# EAGLE design Temp Sensor B (EAGLE 8.4.0)
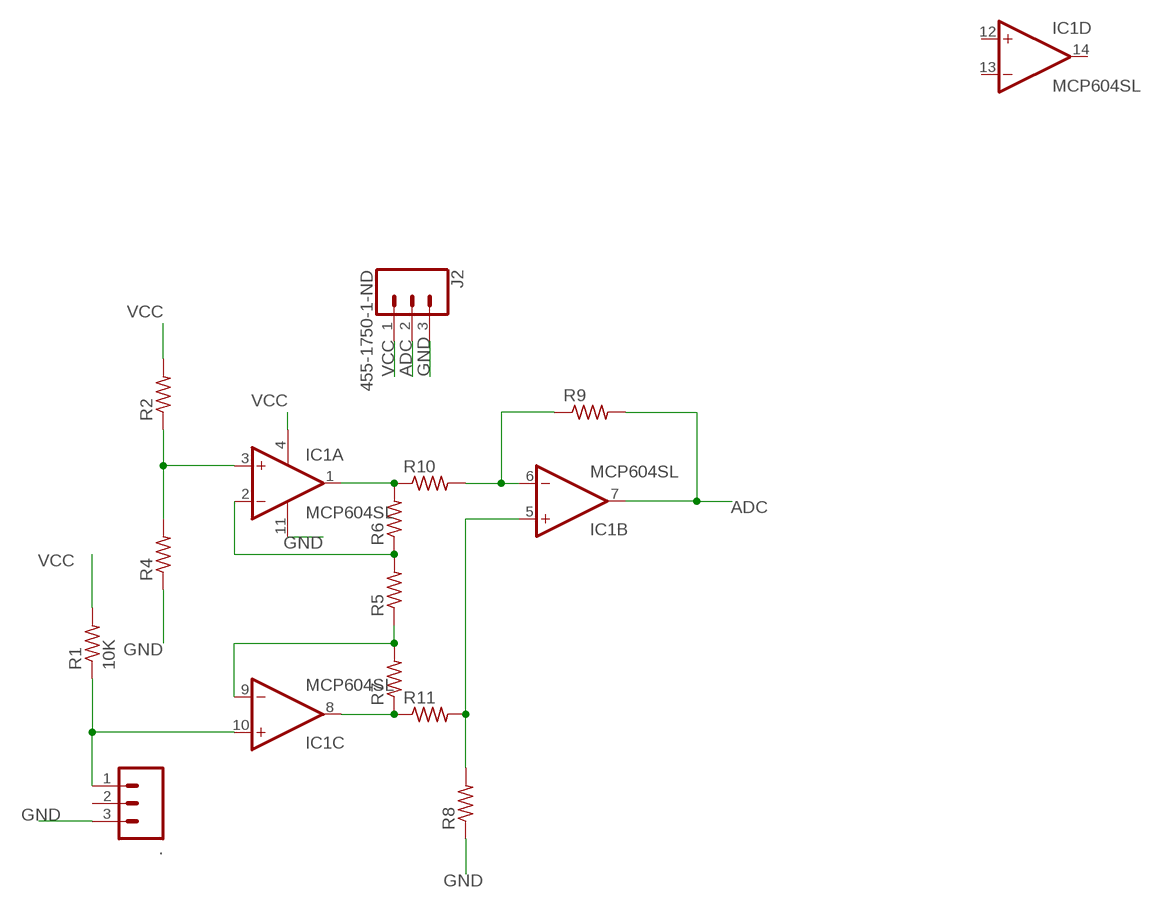
[diagram p0: schematic, sheet 1]

## Parts
.  CONN_03SCREW_LOCK  [SCREWTERMINAL-3.5MM-3_LOCK.007S]
IC1  MCP604SL  [SO14]
J2  455-1750-1-ND  CONN_03  [1X03]
R1  10K  R-US_R0603  [R0603]
R2  R-US_R0603  [R0603]
R4  R-US_R0603  [R0603]
R5  R-US_R0603  [R0603]
R6  R-US_R0603  [R0603]
R7  R-US_R0603  [R0603]
R8  R-US_R0603  [R0603]
R9  R-US_R0603  [R0603]
R10  R-US_R0603  [R0603]
R11  R-US_R0603  [R0603]

## Nets
ADC: IC1.7(B:OUT) J2.2 R9.2
GND: ..3 IC1.11(P:V-) J2.3 R4.1 R8.1
N$1: ..1 IC1.10(C:+IN) R1.1
N$2: IC1.3(A:+IN) R2.1 R4.2
N$3: IC1.8(C:OUT) R7.1 R11.1
N$5: IC1.1(A:OUT) R6.2 R10.1
N$7: IC1.2(A:-IN) R5.2 R6.1
N$8: IC1.9(C:-IN) R5.1 R7.2
N$11: IC1.5(B:+IN) R8.2 R11.2
N$12: IC1.6(B:-IN) R9.1 R10.2
VCC: IC1.4(P:V+) J2.1 R1.2 R2.2
Unconnected: ..2 IC1.12(D:+IN) IC1.13(D:-IN) IC1.14(D:OUT)

## Library data of the parts
. = SparkFun-Connectors:CONN_03: Multi connection point. Often used as Generic Header-pin footprint for 0.1 inch spaced/style header connections On any of the 0.1 inch spaced packages, you can populate with these: Break Away Headers - Straight <https://www.sparkfun.com/products/116> (PRT-00116) Break Away Male Headers - Right Angle <https://www.sparkfun.com/products/553> (PRT-00553) Female Headers <https://www.sparkfun.com/products/115> (PRT-00115) Break Away Headers - Machine Pin <https://www.sparkfun.com/products/117> (PRT-00117) Break Away Female Headers - Swiss Machine Pin <https://www.sparkfun.com/products/743> (PRT-00743) Stackable Header - 3 Pin (Female, 0.1") <https://www.sparkfun.com/products/13875> (PRT-13875) For SCREWTERMINALS and SPRING TERMINALS visit here: Screw Terimnals on SparkFun.com <https://www.sparkfun.com/search/results?term=Screw+Terminals> (5mm/3.5mm/2.54mm spacing) This device is also useful as a general connection point to wire up your design to another part of your project. Our various solder wires solder well into these plated through hole pads. Hook-Up Wire - Assortment (Stranded, 22 AWG) <https://www.sparkfun.com/products/11375> (PRT-11375) Hook-Up Wire - Assortment (Solid Core, 22 AWG) <https://www.sparkfun.com/products/11367> (PRT-11367) View the entire wire category on our website here <https://www.sparkfun.com/categories/141> Special notes: Molex polarized connector foot print use with SKU : PRT-08232 with associated crimp pins and housings.; PROD_ID: CONN-08288; SF_ID: PRT-08235
IC1 = linear:MCP604: Quad Op Amp 2.7V to 6.0V Single Supply CMOS Source: http://ww1.microchip.com/downloads/en/DeviceDoc/21314g.pdf
J2 = SparkFun-Connectors:CONN_03: Multi connection point. Often used as Generic Header-pin footprint for 0.1 inch spaced/style header connections On any of the 0.1 inch spaced packages, you can populate with these: Break Away Headers - Straight <https://www.sparkfun.com/products/116> (PRT-00116) Break Away Male Headers - Right Angle <https://www.sparkfun.com/products/553> (PRT-00553) Female Headers <https://www.sparkfun.com/products/115> (PRT-00115) Break Away Headers - Machine Pin <https://www.sparkfun.com/products/117> (PRT-00117) Break Away Female Headers - Swiss Machine Pin <https://www.sparkfun.com/products/743> (PRT-00743) Stackable Header - 3 Pin (Female, 0.1") <https://www.sparkfun.com/products/13875> (PRT-13875) For SCREWTERMINALS and SPRING TERMINALS visit here: Screw Terimnals on SparkFun.com <https://www.sparkfun.com/search/results?term=Screw+Terminals> (5mm/3.5mm/2.54mm spacing) This device is also useful as a general connection point to wire up your design to another part of your project. Our various solder wires solder well into these plated through hole pads. Hook-Up Wire - Assortment (Stranded, 22 AWG) <https://www.sparkfun.com/products/11375> (PRT-11375) Hook-Up Wire - Assortment (Solid Core, 22 AWG) <https://www.sparkfun.com/products/11367> (PRT-11367) View the entire wire category on our website here <https://www.sparkfun.com/categories/141> Special notes: Molex polarized connector foot print use with SKU : PRT-08232 with associated crimp pins and housings.; PROD_ID: XXX-00000
R1 R2 R4-R11 = resistor:R-US_: RESISTOR, American symbol

## Board
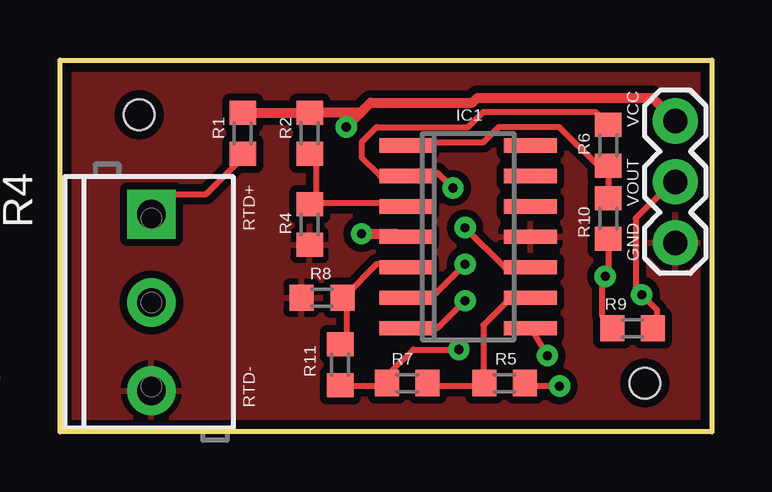
[diagram p1: board, top side]
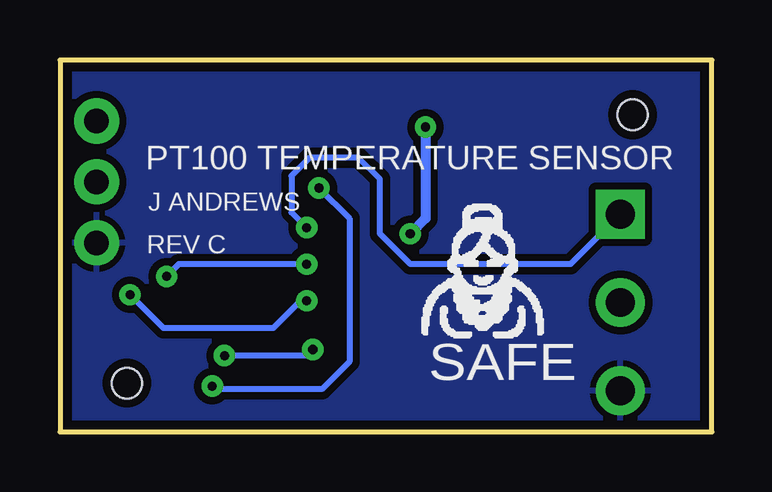
[diagram p2: board, bottom side, seen from below]

Size 27.18 x 15.49 mm. Coordinates in mm from the lower left corner, seen from the top.
Outline: 0,0 0,15.49 27.18,15.49 27.18,0 0,0
Copper layers (1*16): Top 0.0356mm / dielectric 1.5011mm / Bottom 0.0356mm
Design rules "oshpark-2layer *": minimum track width 10mil, minimum drill 15mil, track to track 10mil, track to pad 10mil, pad to pad 10mil, via to via 10mil, smd to smd 6mil, copper to edge 15mil, drill to drill 10mil, minimum pad ring 10mil, minimum via ring 10mil, stop-mask expansion 8mil, vias tented up to drill 8mil, thermal gap 10mil
Holes 1.27 mm at 24.38,2.03 3.3,13.21

### Footprints (pad centres in the part's own frame; a part is rotated, then mirrored left to right if it is on the bottom)
SCREWTERMINAL-3.5MM-3_LOCK.007S = drill 1.2 pad 2.032 square: 1 -0.178,0 | drill 1.2 pad 2.032: 2 3.5,0; 3 7.178,0
SO14 = smd 0.6 x 2.2: 1 -3.81,-2.6; 2 -2.54,-2.6; 3 -1.27,-2.6; 4 0,-2.6; 5 1.27,-2.6; 6 2.54,-2.6; 7 3.81,-2.6; 8 3.81,2.6; 9 2.54,2.6; 10 1.27,2.6; 11 0,2.6; 12 -1.27,2.6; 13 -2.54,2.6; 14 -3.81,2.6
1X03 = drill 1.016 pad 1.88: 1 0,0; 2 2.54,0; 3 5.08,0
R0603 = smd 1 x 1.1: 1 -0.85,0; 2 0.85,0

### Placement (x,y rotation side)
.  3.81,8.89 270 top
IC1  17.02,8.13 270 top
J2  25.65,12.95 270 top
R1  7.62,12.45 90 top
R2  10.41,12.45 90 top
R4  10.41,8.64 90 top
R5  18.54,2.03 0 top
R6  22.86,11.94 270 top
R7  14.48,2.03 0 top
R8  10.92,5.59 0 top
R9  23.88,4.32 0 top
R10  22.86,8.89 270 top
R11  11.68,2.79 90 top

### Tracks (layer width: path | path; a pad name or v marks a point on that pad's centre or on a via)
ADC  (via drill 0.38)
  Top 0.254: J2.2 25.27,10.16 24,8.89 24,5.97 v24.26,5.71 24.89,5.08 24.89,4.48 R9.2 | 14.48,4.45 IC1.7 15.75,4.32 v16.89,5.46
  Bottom 0.254: v16.89,5.46 17.14,5.46 18.29,4.32 22.86,4.32 v24.26,5.71
GND
  pour Top (isolate 0.305): 0,15.49 0,0 27.18,0 27.18,15.49
  pour Bottom (isolate 0.305): 0,15.49 0,0 27.18,0 27.18,15.49
N$1  (via drill 0.38)
  Top 0.254: 7.49,11.43 R1.1 7.62,11.43 6.1,9.91 4.65,9.91 ..1 | 19.56,6.99 IC1.10 18.54,6.86 v16.89,8.51
  Bottom 0.254: ..1 5.89,6.99 12.57,6.99 13.84,8.26 13.84,10.54 14.73,11.43 16.76,11.43 17.53,10.67 17.53,9.14 v16.89,8.51
N$2
  Top 0.254: 10.67,9.53 10.67,11.43 R2.1 | 10.67,9.53 13.84,9.53 IC1.3 | 10.67,9.53 R4.2
N$3  (via drill 0.38)
  Top 0.254: R11.1 11.94,1.91 13.21,1.91 R7.1 13.84,2.54 14.73,3.43 v16.64,3.43 | v20.32,3.17 19.56,4.45 IC1.8
  Bottom 0.254: v16.64,3.43 16.89,3.17 v20.32,3.17
N$5
  Top 0.254: IC1.1 14.48,12.06 17.65,12.06 18.29,12.7 20.83,12.7 22.44,11.09 R6.2 R10.1
N$7  (via drill 0.38)
  Top 0.254: v20.83,1.91 19.56,1.91 R5.2 | v16.38,10.16 15.75,10.79 14.48,10.79 IC1.2 13.34,10.67 12.57,11.43 12.57,12.06 13.21,12.7 17.02,12.7 17.65,13.34 22.31,13.34 R6.1
  Bottom 0.254: v16.38,10.16 15.11,8.89 15.11,2.92 16.26,1.78 20.7,1.78 v20.83,1.91
N$8
  Top 0.254: R7.2 15.75,1.91 17.65,1.91 R5.1 17.65,2.54 17.65,4.45 18.92,5.71 19.56,5.71 IC1.9
N$11
  Top 0.254: R11.2 11.94,3.81 11.94,5.08 R8.2 11.94,5.71 13.21,6.99 13.84,6.99 IC1.5
N$12  (via drill 0.38)
  Top 0.254: 14.48,5.71 IC1.6 15.49,5.59 v16.89,6.99 | R10.2 22.86,6.6 v22.73,6.48 22.61,6.35 22.61,4.83 23.03,4.41 R9.1
  Bottom 0.254: v16.89,6.99 22.23,6.99 v22.73,6.48
VCC  (via drill 0.38)
  Top 0.254: IC1.4 14.04,8.21 13.84,8.26
  Top 0.406: R1.2 R2.2 12.53,13.3 | 12.53,13.3 12.95,13.72 17.21,13.72 17.41,13.92 24.69,13.92 J2.1 | v11.94,12.7 12.53,13.3 | v12.57,8.26 14,8.26 14.04,8.21
  Bottom 0.406: v12.57,8.26 11.94,8.89 v11.94,12.7

### Text on the board
tPlace: IC1 | VCC | R1 | R2 | R6 | R4 | R10 | VOUT | RTD+ | GND | R8 | R9 | R7 | R5 | R11 | RTD-
bPlace: PT100 TEMPERATURE SENSOR | J ANDREWS | REV C | SAFE
201bmp: C:/Users/Josh Andrews/Desktop/ECE 400/Granny Logo.bmp